# Altium project demo_dermis_main_testboard.PrjPcb (part 2 of 2)

## Sheet demo_dermis_main_testboard_back.SchDoc
size E
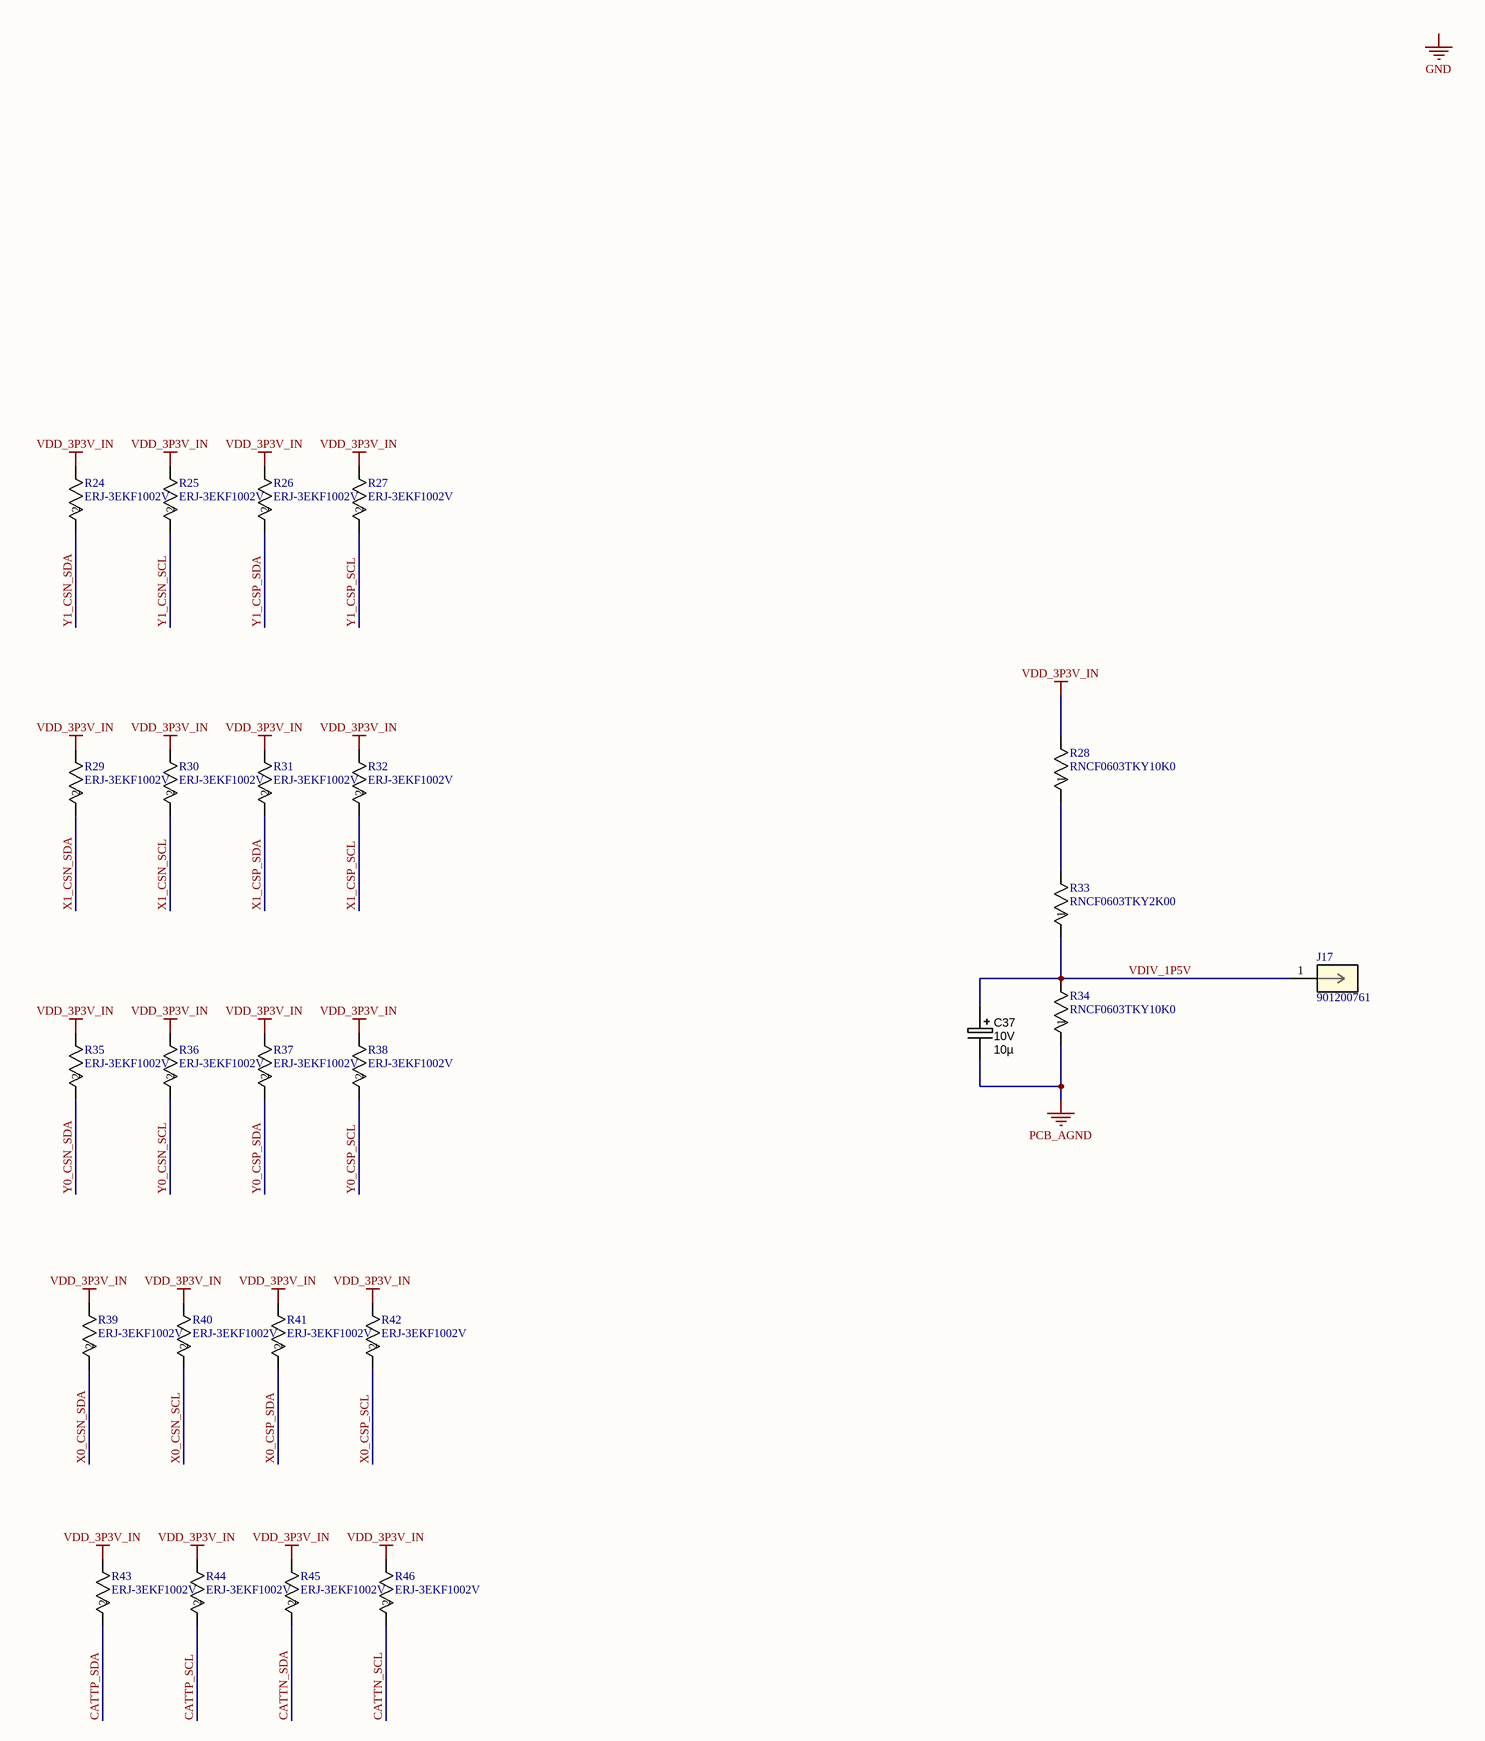
[diagram p19: demo_dermis_main_testboard_back.SchDoc]

### Parts
C37  Ratings: 10V  [CAPMP2012X150USR]  (hidden comment: 10µ)
J17  901200761  [CONN_90120-0761_MOL]
R24  ERJ-3EKF1002V  [RC0603N_PAN]
R25  ERJ-3EKF1002V  [RC0603N_PAN]
R26  ERJ-3EKF1002V  [RC0603N_PAN]
R27  ERJ-3EKF1002V  [RC0603N_PAN]
R28  RNCF0603TKY10K0  [STA_RNCF0603_STP]
R29  ERJ-3EKF1002V  [RC0603N_PAN]
R30  ERJ-3EKF1002V  [RC0603N_PAN]
R31  ERJ-3EKF1002V  [RC0603N_PAN]
R32  ERJ-3EKF1002V  [RC0603N_PAN]
R33  RNCF0603TKY2K00  [RES_RNCF0603_STP]
R34  RNCF0603TKY10K0  [STA_RNCF0603_STP]
R35  ERJ-3EKF1002V  [RC0603N_PAN]
R36  ERJ-3EKF1002V  [RC0603N_PAN]
R37  ERJ-3EKF1002V  [RC0603N_PAN]
R38  ERJ-3EKF1002V  [RC0603N_PAN]
R39  ERJ-3EKF1002V  [RC0603N_PAN]
R40  ERJ-3EKF1002V  [RC0603N_PAN]
R41  ERJ-3EKF1002V  [RC0603N_PAN]
R42  ERJ-3EKF1002V  [RC0603N_PAN]
R43  ERJ-3EKF1002V  [RC0603N_PAN]
R44  ERJ-3EKF1002V  [RC0603N_PAN]
R45  ERJ-3EKF1002V  [RC0603N_PAN]
R46  ERJ-3EKF1002V  [RC0603N_PAN]

### Nets
PCB_AGND: C37.2 R34.1
VDD_3P3V_IN: R24.1 R25.1 R26.1 R27.1 R28.2 R29.1 R30.1 R31.1 R32.1 R35.1 R36.1 R37.1 R38.1 R39.1 R40.1 R41.1 R42.1 R43.1 R44.1 R45.1 R46.1
CATTN_SCL: R46.2
CATTN_SDA: R45.2
CATTP_SCL: R44.2
CATTP_SDA: R43.2
VDIV_1P5V: C37.1 J17.1 R33.1 R34.2
X0_CSN_SCL: R40.2
X0_CSN_SDA: R39.2
X0_CSP_SCL: R42.2
X0_CSP_SDA: R41.2
X1_CSN_SCL: R30.2
X1_CSN_SDA: R29.2
X1_CSP_SCL: R32.2
X1_CSP_SDA: R31.2
Y0_CSN_SCL: R36.2
Y0_CSN_SDA: R35.2
Y0_CSP_SCL: R38.2
Y0_CSP_SDA: R37.2
Y1_CSN_SCL: R25.2
Y1_CSN_SDA: R24.2
Y1_CSP_SCL: R27.2
Y1_CSP_SDA: R26.2
NetR28_1: R28.1 R33.2

### Notes on the sheet
- Labels drawn without touching a wire or pin: GND

### Library data of the parts
C37 = CAPT_10u_0805_10V: Capacitor SMD Tantalum 10uF 20% 10V 0805; Manufacturer 1: AVX Corporation; Manufacturer Part Number 1: TAJP106M010RNJ; Package / Case: 0805 (2012 metric); Tolerance: ±20%; Material: Tantalum; Supplier 1: Digi-Key; Supplier Part Number 1: 478-3281-1-ND; Value: 10µ
J17 = 901200761: No Description Available; Mfr_Name: Molex Connector Corporation; Copyright: Copyright (C) 2022 Ultra Librarian. All rights reserved.; Manufacturer_Part_Number: 901200761; RefDes: RefDes; Type: DEV
R24-R27 R29-R32 R35-R46 = ERJ-3EKF1002V: No Description Available; Mfr_Name: Panasonic
R28 R34 = RNCF0603TKY10K0: No Description Available; Mfr_Name: Stackpole International
R33 = RNCF0603TKY2K00: No Description Available; Mfr_Name: Stackpole International

## Nets that join several sheets
AGND: demo_dermis_main_testboard (J13.10 R3.2), demo_dermis_main_testboard_ncd2400 (P12.3)
GND: demo_dermis_main_testboard (24 pins), demo_dermis_main_testboard_ncd2400 (108 pins), demo_dermis_main_testboard_ibias (34 pins), demo_dermis_main_testboard_inamps (41 pins)
PCB_AGND: demo_dermis_main_testboard (R4.2), demo_dermis_main_testboard_ibias (26 pins), demo_dermis_main_testboard_inamps (20 pins), demo_dermis_main_testboard_back (C37.2 R34.1)
PCB_DGND: demo_dermis_main_testboard (R5.2), demo_dermis_main_testboard_inamps (C113.2 C114.2 U66.3), demo_dermis_main_testboard_dig (184 pins)
VDD_3P3V_IN: demo_dermis_main_testboard (J3.1 P3.1), demo_dermis_main_testboard_ncd2400 (72 pins), demo_dermis_main_testboard_inamps (C113.1 C114.1 U66.5), demo_dermis_main_testboard_dig (39 pins), demo_dermis_main_testboard_back (21 pins)
VDD_5V_IN: demo_dermis_main_testboard (J1.1 P1.1 VDD_1.A), demo_dermis_main_testboard_ibias (24 pins), demo_dermis_main_testboard_inamps (30 pins)
VNEG: demo_dermis_main_testboard (J2.1 P2.1), demo_dermis_main_testboard_inamps (15 pins)
ACK: demo_dermis_main_testboard (J13.37), demo_dermis_main_testboard_dig (J19.4 P29.2 U40.4)
ADDRX0: demo_dermis_main_testboard (J13.31), demo_dermis_main_testboard_dig (J19.13 P36.1 U46.2)
ADDRX1: demo_dermis_main_testboard (J13.29), demo_dermis_main_testboard_dig (J19.16 P37.1 U47.2)
ADDRX2: demo_dermis_main_testboard (J13.27), demo_dermis_main_testboard_dig (J19.19 P34.1 U44.2)
ADDRY0: demo_dermis_main_testboard (J13.25), demo_dermis_main_testboard_dig (J19.22 P39.1 U49.2)
AER_DIS: demo_dermis_main_testboard (J13.36), demo_dermis_main_testboard_dig (J18.D20 J19.46 U50.40)
CATTN_SCL: demo_dermis_main_testboard_ncd2400 (9 pins), demo_dermis_main_testboard_dig (J18.G13 U50.25), demo_dermis_main_testboard_back (R46.2)
CATTN_SDA: demo_dermis_main_testboard_ncd2400 (9 pins), demo_dermis_main_testboard_dig (J18.G12 U50.26), demo_dermis_main_testboard_back (R45.2)
CATTP_SCL: demo_dermis_main_testboard_ncd2400 (9 pins), demo_dermis_main_testboard_dig (J18.G16 U50.12), demo_dermis_main_testboard_back (R44.2)
CATTP_SDA: demo_dermis_main_testboard_ncd2400 (9 pins), demo_dermis_main_testboard_dig (J18.G15 U50.24), demo_dermis_main_testboard_back (R43.2)
CSb_IDAC: demo_dermis_main_testboard_ibias (U54.14), demo_dermis_main_testboard_dig (J18.C30 J19.70 U50.19)
CSb_VDAC: demo_dermis_main_testboard_ibias (U52.14), demo_dermis_main_testboard_dig (J18.C26 J19.64 U50.17)
CSb_VDAC_COMP: demo_dermis_main_testboard_ibias (U69.14), demo_dermis_main_testboard_dig (J18.C27 J19.67 U50.18)
CT_MODE: demo_dermis_main_testboard (J13.19), demo_dermis_main_testboard_dig (J18.D24 J19.55 U50.14)
GAIN_HI: demo_dermis_main_testboard (J13.40), demo_dermis_main_testboard_dig (J18.D23 J19.52 U50.13)
IBIAS_ADAPT: demo_dermis_main_testboard (J13.28), demo_dermis_main_testboard_ibias (P48.2)
IBIAS_AFE: demo_dermis_main_testboard (J13.26), demo_dermis_main_testboard_ibias (P47.2)
IBIAS_SLEW: demo_dermis_main_testboard (J13.24), demo_dermis_main_testboard_ibias (P46.2)
LDACb: demo_dermis_main_testboard_ibias (U52.18 U54.18 U69.18), demo_dermis_main_testboard_dig (J18.D27 J19.61 U50.16)
RATIOMODE0: demo_dermis_main_testboard (J13.23), demo_dermis_main_testboard_dig (J18.D17 J19.25 U50.38)
RATIOMODE1: demo_dermis_main_testboard (J13.21), demo_dermis_main_testboard_dig (J18.D18 J19.28 U50.39)
REQOFF: demo_dermis_main_testboard (J13.33), demo_dermis_main_testboard_dig (J19.10 P33.1 U42.2)
REQON: demo_dermis_main_testboard (J13.35), demo_dermis_main_testboard_dig (J19.7 P32.1 U41.2)
RESETb: demo_dermis_main_testboard_ibias (U52.19 U54.19 U69.19), demo_dermis_main_testboard_dig (J18.D26 J19.58 U50.15)
RST: demo_dermis_main_testboard (J13.39), demo_dermis_main_testboard_dig (J19.1 P31.2 U39.4)
SCLK: demo_dermis_main_testboard_ibias (U52.13 U54.13 U69.13), demo_dermis_main_testboard_dig (J18.H04 J19.73 U50.20)
SDI: demo_dermis_main_testboard_ibias (U52.12 U54.12 U69.12), demo_dermis_main_testboard_dig (J18.H05 J19.76 U50.21)
SER_CLK: demo_dermis_main_testboard (J13.14), demo_dermis_main_testboard_dig (J19.34 P30.2 U43.4)
SER_EN: demo_dermis_main_testboard (J13.20), demo_dermis_main_testboard_dig (J19.43 P28.2 U38.4)
SER_IN: demo_dermis_main_testboard (J13.16), demo_dermis_main_testboard_dig (J19.37 P27.2 U37.4)
SER_OUT: demo_dermis_main_testboard (J13.18), demo_dermis_main_testboard_dig (J19.40 P38.1 U48.2)
SPKGATE: demo_dermis_main_testboard (J13.38), demo_dermis_main_testboard_dig (J18.D21 J19.49 U50.41)
STATE_OUT: demo_dermis_main_testboard (J13.12), demo_dermis_main_testboard_dig (J19.31 P35.1 U45.2)
VCM: demo_dermis_main_testboard (36 pins), demo_dermis_main_testboard_ncd2400 (17 pins), demo_dermis_main_testboard_ibias (P44.1 U52.9), demo_dermis_main_testboard_inamps (P61.1 P62.1)
VCM_INAMP: demo_dermis_main_testboard_ibias (P72.1 U69.9), demo_dermis_main_testboard_inamps (P73.3)
VINN_COMP: demo_dermis_main_testboard (J12.6), demo_dermis_main_testboard_ibias (C132.1 P75.1 R80.1)
VINN_OTA: demo_dermis_main_testboard (J12.16), demo_dermis_main_testboard_inamps (P55.2)
VINN_X0: demo_dermis_main_testboard (J11.20), demo_dermis_main_testboard_ncd2400 (P17.1 U14.3)
VINN_X0_2: demo_dermis_main_testboard (J12.21), demo_dermis_main_testboard_ncd2400 (U7.3)
VINN_X0_3: demo_dermis_main_testboard (J12.28), demo_dermis_main_testboard_ncd2400 (U27.3)
VINN_X1: demo_dermis_main_testboard (J11.39), demo_dermis_main_testboard_ncd2400 (P18.1 U15.3)
VINN_Y0: demo_dermis_main_testboard (J11.32), demo_dermis_main_testboard_ncd2400 (P24.1 U28.3)
VINN_Y0_1: demo_dermis_main_testboard (J11.6), demo_dermis_main_testboard_ncd2400 (U3.3)
VINN_Y0_2: demo_dermis_main_testboard (J12.7), demo_dermis_main_testboard_ncd2400 (U13.3)
VINN_Y0_3: demo_dermis_main_testboard (J12.31), demo_dermis_main_testboard_ncd2400 (U31.3)
VINN_Y1: demo_dermis_main_testboard (J11.25), demo_dermis_main_testboard_ncd2400 (P11.1 U2.3)
VINP_COMP: demo_dermis_main_testboard (J12.4), demo_dermis_main_testboard_ibias (C130.1 P74.1 R78.1)
VINP_OTA: demo_dermis_main_testboard (J12.14), demo_dermis_main_testboard_inamps (P54.2)
VINP_X0: demo_dermis_main_testboard (J11.28), demo_dermis_main_testboard_ncd2400 (P21.1 U20.3)
VINP_X0_2: demo_dermis_main_testboard (J12.11), demo_dermis_main_testboard_ncd2400 (U1.3)
VINP_X0_3: demo_dermis_main_testboard (J12.38), demo_dermis_main_testboard_ncd2400 (U21.3)
VINP_X1: demo_dermis_main_testboard (J11.37), demo_dermis_main_testboard_ncd2400 (P22.1 U22.3)
VINP_Y0: demo_dermis_main_testboard (J11.30), demo_dermis_main_testboard_ncd2400 (P26.1 U32.3)
VINP_Y0_1: demo_dermis_main_testboard (J11.4), demo_dermis_main_testboard_ncd2400 (U9.3)
VINP_Y0_2: demo_dermis_main_testboard (J12.9), demo_dermis_main_testboard_ncd2400 (U18.3)
VINP_Y0_3: demo_dermis_main_testboard (J12.33), demo_dermis_main_testboard_ncd2400 (U35.3)
VINP_Y1: demo_dermis_main_testboard (J11.35), demo_dermis_main_testboard_ncd2400 (P14.1 U8.3)
VN_X0: demo_dermis_main_testboard (J11.16), demo_dermis_main_testboard_ncd2400 (P15.1 R13.2 U14.2)
VN_X0_2: demo_dermis_main_testboard (J12.17), demo_dermis_main_testboard_ncd2400 (R9.2 U7.2)
VN_X0_3: demo_dermis_main_testboard (J12.32), demo_dermis_main_testboard_ncd2400 (R19.2 U27.2)
VN_X1: demo_dermis_main_testboard (J11.19), demo_dermis_main_testboard_ncd2400 (P16.1 R14.2 U15.2)
VN_Y0: demo_dermis_main_testboard (J11.38), demo_dermis_main_testboard_ncd2400 (P23.1 R20.2 U28.2)
VN_Y0_1: demo_dermis_main_testboard (J11.12), demo_dermis_main_testboard_ncd2400 (R8.2 U3.2)
VN_Y0_2: demo_dermis_main_testboard (J12.1), demo_dermis_main_testboard_ncd2400 (R12.2 U13.2)
VN_Y0_3: demo_dermis_main_testboard (J12.25), demo_dermis_main_testboard_ncd2400 (R21.2 U31.2)
VN_Y1: demo_dermis_main_testboard (J11.29), demo_dermis_main_testboard_ncd2400 (P10.1 R7.2 U2.2)
VOUT_COMP: demo_dermis_main_testboard (J12.2), demo_dermis_main_testboard_inamps (P53.1 U66.2)
VOUT_COMP_EXT: demo_dermis_main_testboard_inamps (J23.2 P53.2 U66.4), demo_dermis_main_testboard_dig (J18.G36 U50.22)
VOUTN_OTA: demo_dermis_main_testboard (J12.10), demo_dermis_main_testboard_inamps (P63.1 R57.2)
VOUTN_X0: demo_dermis_main_testboard (J12.24), demo_dermis_main_testboard_inamps (P71.2)
VOUTN_Y0: demo_dermis_main_testboard (J12.20), demo_dermis_main_testboard_inamps (P59.2)
VOUTP_OTA: demo_dermis_main_testboard (J12.12), demo_dermis_main_testboard_inamps (P60.1 R58.2)
VOUTP_X0: demo_dermis_main_testboard (J12.26), demo_dermis_main_testboard_inamps (P70.2)
VOUTP_Y0: demo_dermis_main_testboard (J12.22), demo_dermis_main_testboard_inamps (P58.2)
VP_X0: demo_dermis_main_testboard (J11.24), demo_dermis_main_testboard_ncd2400 (P19.1 R16.2 U20.2)
VP_X0_2: demo_dermis_main_testboard (J12.15), demo_dermis_main_testboard_ncd2400 (R6.2 U1.2)
VP_X0_3: demo_dermis_main_testboard (J12.34), demo_dermis_main_testboard_ncd2400 (R17.2 U21.2)
VP_X1: demo_dermis_main_testboard (J11.21), demo_dermis_main_testboard_ncd2400 (P20.1 R18.2 U22.2)
VP_Y0: demo_dermis_main_testboard (J11.36), demo_dermis_main_testboard_ncd2400 (P25.1 R22.2 U32.2)
VP_Y0_1: demo_dermis_main_testboard (J11.10), demo_dermis_main_testboard_ncd2400 (R11.2 U9.2)
VP_Y0_2: demo_dermis_main_testboard (J12.3), demo_dermis_main_testboard_ncd2400 (R15.2 U18.2)
VP_Y0_3: demo_dermis_main_testboard (J12.27), demo_dermis_main_testboard_ncd2400 (R23.2 U35.2)
VP_Y1: demo_dermis_main_testboard (J11.31), demo_dermis_main_testboard_ncd2400 (P13.1 R10.2 U8.2)
VTRIG_COMP: demo_dermis_main_testboard (J13.30), demo_dermis_main_testboard_ibias (P44.5 U52.3)
VTUNE_PSEUDO: demo_dermis_main_testboard (J13.32), demo_dermis_main_testboard_ibias (P44.3 U52.8)
X0_CSN_SCL: demo_dermis_main_testboard_ncd2400 (U7.6 U14.6 U27.6), demo_dermis_main_testboard_dig (J18.G09 U50.28), demo_dermis_main_testboard_back (R40.2)
X0_CSN_SDA: demo_dermis_main_testboard_ncd2400 (U7.1 U14.1 U27.1), demo_dermis_main_testboard_dig (J18.G10 U50.27), demo_dermis_main_testboard_back (R39.2)
X0_CSP_SCL: demo_dermis_main_testboard_ncd2400 (U1.6 U20.6 U21.6), demo_dermis_main_testboard_dig (J18.G06 U50.30), demo_dermis_main_testboard_back (R42.2)
X0_CSP_SDA: demo_dermis_main_testboard_ncd2400 (U1.1 U20.1 U21.1), demo_dermis_main_testboard_dig (J18.G07 U50.29), demo_dermis_main_testboard_back (R41.2)
X1_CSN_SCL: demo_dermis_main_testboard_ncd2400 (U15.6), demo_dermis_main_testboard_dig (J18.G28 U50.4), demo_dermis_main_testboard_back (R30.2)
X1_CSN_SDA: demo_dermis_main_testboard_ncd2400 (U15.1), demo_dermis_main_testboard_dig (J18.G27 U50.5), demo_dermis_main_testboard_back (R29.2)
X1_CSP_SCL: demo_dermis_main_testboard_ncd2400 (U22.6), demo_dermis_main_testboard_dig (J18.G25 U50.6), demo_dermis_main_testboard_back (R32.2)
X1_CSP_SDA: demo_dermis_main_testboard_ncd2400 (U22.1), demo_dermis_main_testboard_dig (J18.G24 U50.7), demo_dermis_main_testboard_back (R31.2)
Y0_CSN_SCL: demo_dermis_main_testboard_ncd2400 (U3.6 U13.6 U28.6 U31.6), demo_dermis_main_testboard_dig (J18.G22 U50.8), demo_dermis_main_testboard_back (R36.2)
Y0_CSN_SDA: demo_dermis_main_testboard_ncd2400 (U3.1 U13.1 U28.1 U31.1), demo_dermis_main_testboard_dig (J18.G21 U50.9), demo_dermis_main_testboard_back (R35.2)
Y0_CSP_SCL: demo_dermis_main_testboard_ncd2400 (U9.6 U18.6 U32.6 U35.6), demo_dermis_main_testboard_dig (J18.G19 U50.10), demo_dermis_main_testboard_back (R38.2)
Y0_CSP_SDA: demo_dermis_main_testboard_ncd2400 (U9.1 U18.1 U32.1 U35.1), demo_dermis_main_testboard_dig (J18.G18 U50.11), demo_dermis_main_testboard_back (R37.2)
Y1_CSN_SCL: demo_dermis_main_testboard_ncd2400 (U2.6), demo_dermis_main_testboard_dig (J18.G34 U50.0), demo_dermis_main_testboard_back (R25.2)
Y1_CSN_SDA: demo_dermis_main_testboard_ncd2400 (U2.1), demo_dermis_main_testboard_dig (J18.G33 U50.1), demo_dermis_main_testboard_back (R24.2)
Y1_CSP_SCL: demo_dermis_main_testboard_ncd2400 (U8.6), demo_dermis_main_testboard_dig (J18.G31 U50.2), demo_dermis_main_testboard_back (R27.2)
Y1_CSP_SDA: demo_dermis_main_testboard_ncd2400 (U8.1), demo_dermis_main_testboard_dig (J18.G30 U50.3), demo_dermis_main_testboard_back (R26.2)